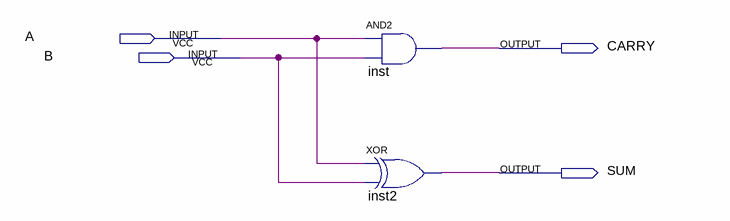
[diagram p0: schematic sheet]
// Quartus schematic half_adder.bdf as structural Verilog: 2 symbols, 4 pins
module half_adder (
  input  A,
  input  B,
  output CARRY,
  output SUM
);

  and inst (CARRY, A, B);
  xor inst2 (SUM, A, B);
endmodule
